# EAGLE design XT-03_Bit Reducer (EAGLE 9.5.1)
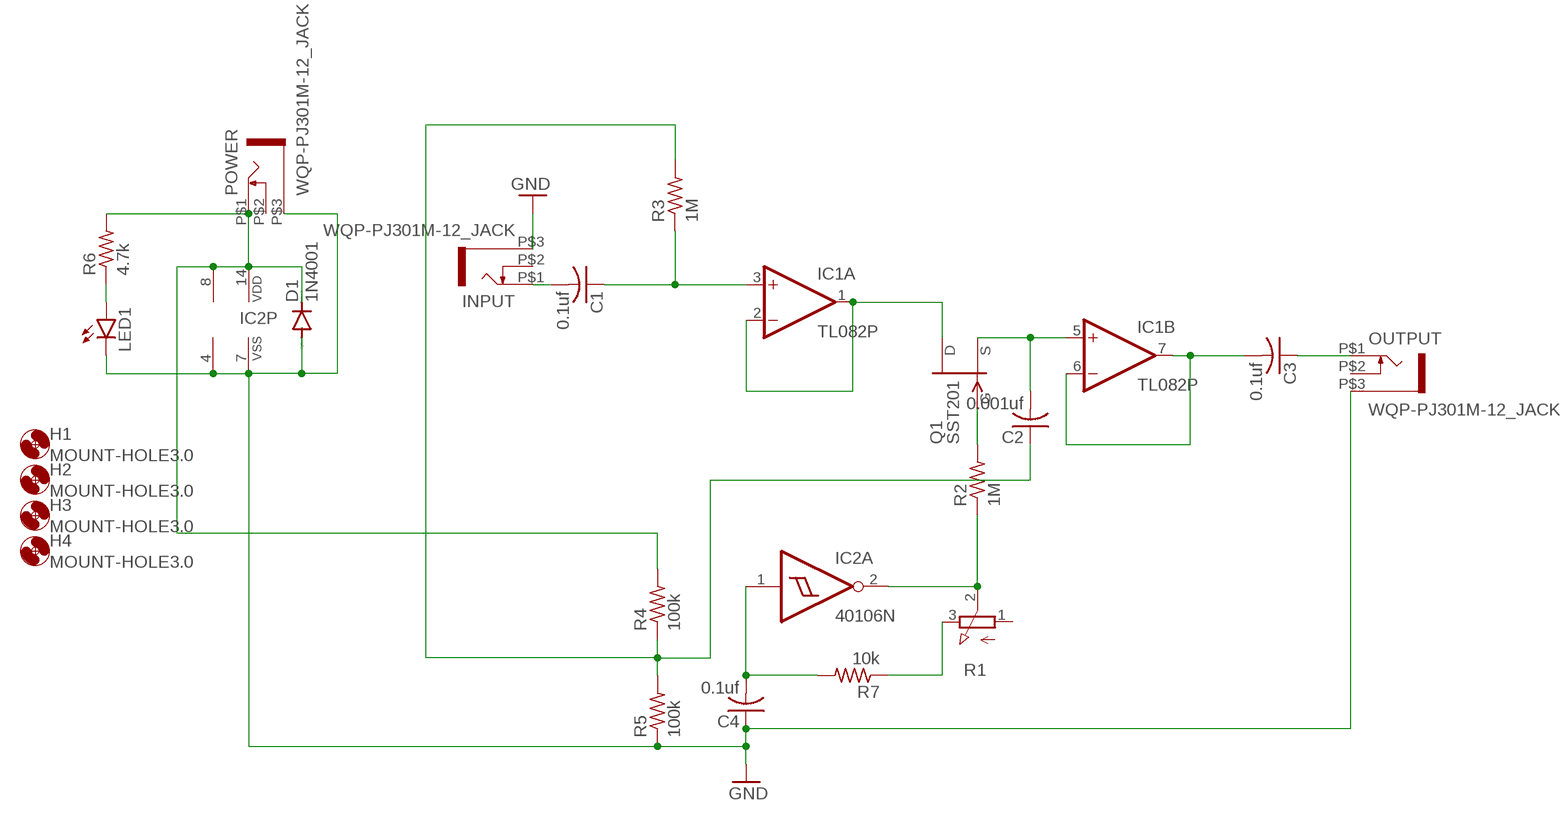
[diagram p0: schematic, sheet 1]

## Parts
C1  0.1uf  C-US050-025X075  [C050-025X075]
C2  0.001uf  C-US050-025X075  [C050-025X075]
C3  0.1uf  C-US050-025X075  [C050-025X075]
C4  0.1uf  C-US050-025X075  [C050-025X075]
D1  1N4001  1N4004  [DO41-10]
H1  MOUNT-HOLE3.0  [3,0]
H2  MOUNT-HOLE3.0  [3,0]
H3  MOUNT-HOLE3.0  [3,0]
H4  MOUNT-HOLE3.0  [3,0]
IC1  TL082P  [DIL08]
IC2  40106N  [DIL14]
INPUT  WQP-PJ301M-12_JACK  [WQP-PJ301M-12_JACK]
LED1  LED3MM  [LED3MM]
OUTPUT  WQP-PJ301M-12_JACK  [WQP-PJ301M-12_JACK]
POWER  WQP-PJ301M-12_JACK  [WQP-PJ301M-12_JACK]
Q1  SST201  [SOT23]
R1  EVUF2L  [EVUFXL]
R2  1M  R-US_0207/7  [0207/7]
R3  1M  R-US_0207/7  [0207/7]
R4  100k  R-US_0207/7  [0207/7]
R5  100k  R-US_0207/7  [0207/7]
R6  4.7k  R-US_0207/7  [0207/7]
R7  10k  R-US_0207/7  [0207/7]

## Nets
GND: C4.1 D1.A IC1.4(P:V-) IC2.7(P:VSS) INPUT.P$3 LED1.K(C) OUTPUT.P$3 POWER.P$3 R5.1
N$1: Q1.3(G) R2.2
N$2: IC1.1(A:OUT) IC1.2(A:-IN) Q1.1(D)
N$3: C1.1 IC1.3(A:+IN) R3.1
N$4: C2.2 IC1.5(B:+IN) Q1.2(S)
N$5: C3.2 IC1.6(B:-IN) IC1.7(B:OUT)
N$6: C1.2 INPUT.P$1
N$7: C2.1 R3.2 R4.1 R5.2
N$8: C3.1 OUTPUT.P$1
N$9: LED1.A R6.1
N$10: IC2.2(A:O) R1.2(S) R2.1
N$11: R1.3(E) R7.1
N$14: C4.2 IC2.1(A:I) R7.2
N$21: D1.C IC1.8(P:V+) IC2.14(P:VDD) POWER.P$1 R4.2 R6.2
Unconnected: IC2.3(B:I) IC2.4(B:O) IC2.5(C:I) IC2.6(C:O) IC2.8(D:O) IC2.9(D:I) IC2.10(E:O) IC2.11(E:I) IC2.12(F:O) IC2.13(F:I) INPUT.P$2 OUTPUT.P$2 POWER.P$2 R1.1(A)

## Library data of the parts
C1-C4 = rcl:C-US: CAPACITOR, American symbol; SPICEPREFIX: C
D1 = diode:1N4004: DIODE general purpose rectifier, 1 A
H1-H4 = holes:MOUNT-HOLE: MOUNTING HOLE with drill center marker
IC1 = linear:TL082: OP AMP Data sheet <http://www.ti.com/lit/ds/symlink/tl084a . pdf>; DATA_SHEET: <a href="http://www.ti.com/lit/ds/symlink/tl084a.pdf"> Data sheet </a>
IC2 = 40xx:40106: Hex SCHMITT TRIGGER
INPUT OUTPUT POWER = thonkiconn:WQP-PJ301M-12_JACK
LED1 = led:LED: LED OSRAM: - CHIPLED LG R971, LG N971, LY N971, LG Q971, LY Q971, LO R971, LY R971 LH N974, LH R974 LS Q976, LO Q976, LY Q976 LO Q996 - Hyper CHIPLED LW Q18S LB Q993, LB Q99A, LB R99A - SideLED LS A670, LO A670, LY A670, LG A670, LP A670 LB A673, LV A673, LT A673, LW A673 LH A674 LY A675 LS A676, LA A676, LO A676, LY A676, LW A676 LS A679, LY A679, LG A679 - Hyper Micro SIDELED® LS Y876, LA Y876, LO Y876, LY Y876 LT Y87S - SmartLED LW L88C, LW L88S LB L89C, LB L89S, LG L890 LS L89K, LO L89K, LY L89K LS L896, LA L896, LO L896, LY L896 - TOPLED LS T670, LO T670, LY T670, LG T670, LP T670 LSG T670, LSP T670, LSY T670, LOP T670, LYG T670 LG T671, LOG T671, LSG T671 LB T673, LV T673, LT T673, LW T673 LH T674 LS T676, LA T676, LO T676, LY T676, LB T676, LH T676, LSB T676, LW T676 LB T67C, LV T67C, LT T67C, LS T67K, LO T67K, LY T67K, LW E67C LS E67B, LA E67B, LO E67B, LY E67B, LB E67C, LV E67C, LT E67C LW T67C LS T679, LY T679, LG T679 LS T770, LO T770, LY T770, LG T770, LP T770 LB T773, LV T773, LT T773, LW T773 LH T774 LS E675, LA E675, LY E675, LS T675 LS T776, LA T776, LO T776, LY T776, LB T776 LHGB T686 LT T68C, LB T68C - Hyper Mini TOPLED® LB M676 - Mini TOPLED Santana® LG M470 LS M47K, LO M47K, LY M47K Source: http://www.osram.convergy.de LUXEON: - LUMILED® LXK2-PW12-R00, LXK2-PW12-S00, LXK2-PW14-U00, LXK2-PW14-V00 LXK2-PM12-R00, LXK2-PM12-S00, LXK2-PM14-U00 LXK2-PE12-Q00, LXK2-PE12-R00, LXK2-PE12-S00, LXK2-PE14-T00, LXK2-PE14-U00 LXK2-PB12-K00, LXK2-PB12-L00, LXK2-PB12-M00, LXK2-PB14-N00, LXK2-PB14-P00, LXK2-PB14-Q00 LXK2-PR12-L00, LXK2-PR12-M00, LXK2-PR14-Q00, LXK2-PR14-R00 LXK2-PD12-Q00, LXK2-PD12-R00, LXK2-PD12-S00 LXK2-PH12-R00, LXK2-PH12-S00 LXK2-PL12-P00, LXK2-PL12-Q00, LXK2-PL12-R00 Source: www.luxeon.com KINGBRIGHT: KA-3528ASYC Source: www.kingbright.com
Q1 = transistor-fet:?20*: TEMIC / Siliconix N-Channel JFET Source: JFET-J201_Siliconix_data.pdf
R1 = pot:EVU: 9 mm Square Rotary Potentiometers Source: Panasonic
R2-R7 = rcl:R-US_: RESISTOR, American symbol; SPICEPREFIX: R

## Board
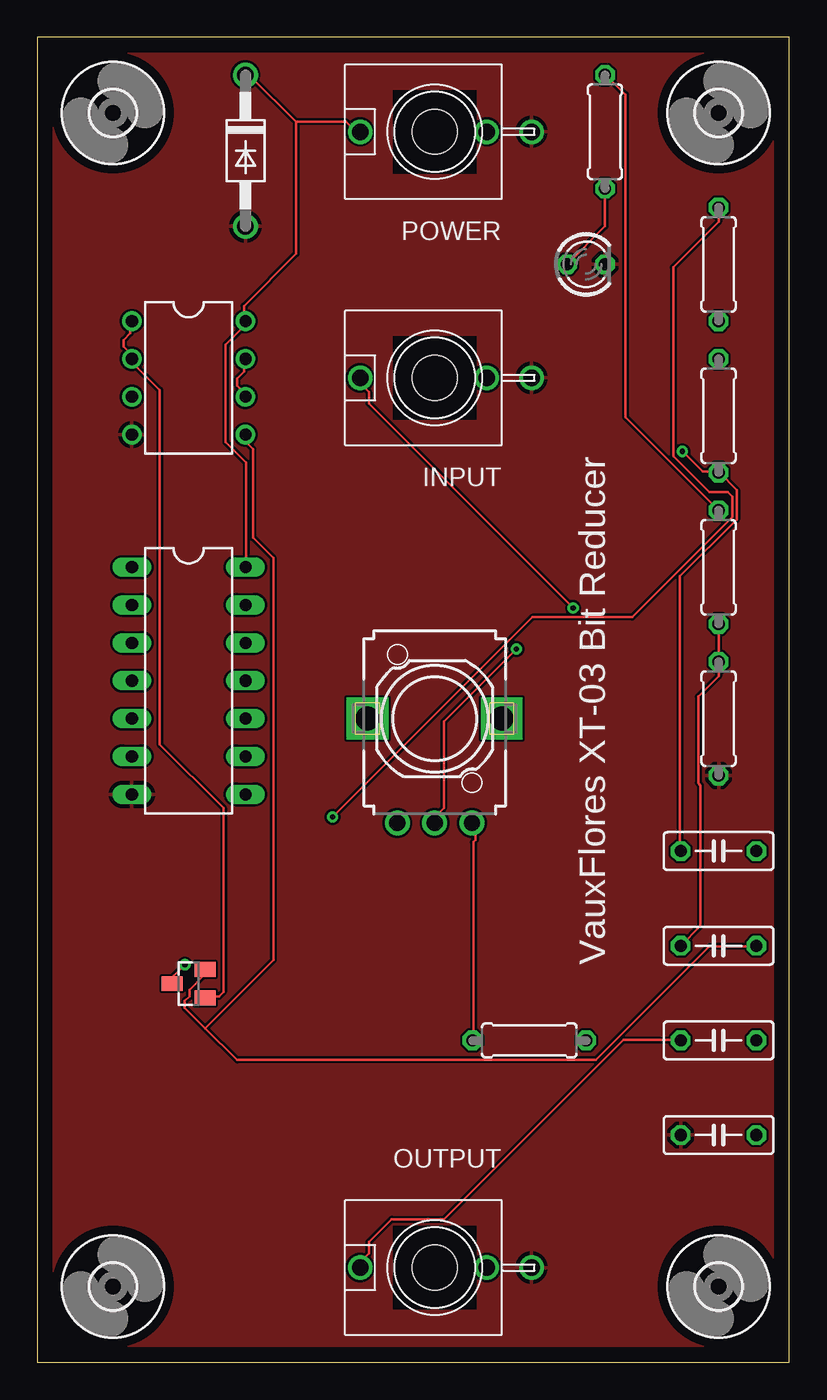
[diagram p1: board, top side]
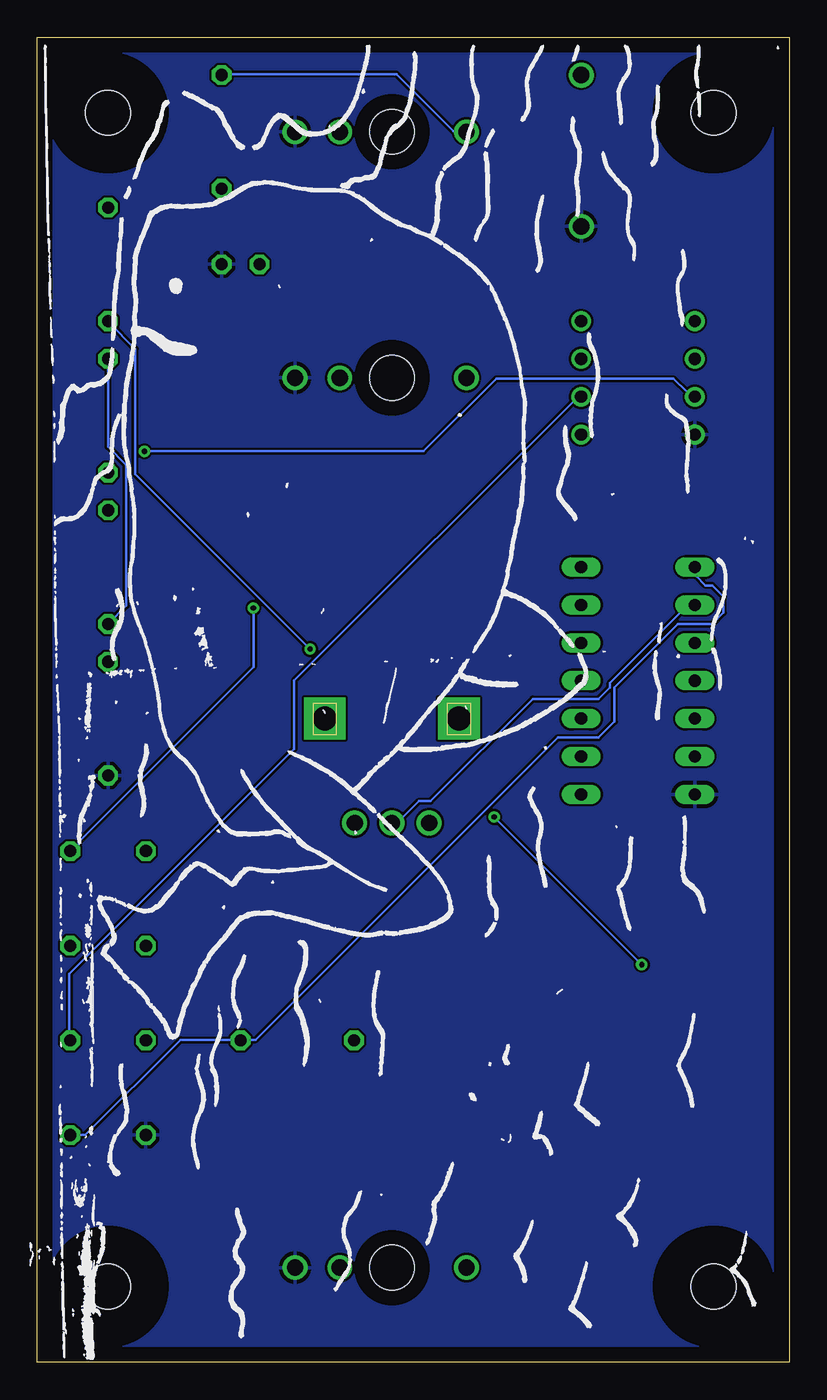
[diagram p2: board, bottom side, seen from below]

Size 50.47 x 88.89 mm. Coordinates in mm from the lower left corner, seen from the top.
Outline: 0,0 50.47,0 50.47,88.89 0,88.89 0,0
Copper layers (1*16): Top 0.035mm / dielectric 1.5mm / Bottom 0.035mm
Design rules "default": minimum track width 6mil, minimum drill 0.35mm, track to track 6mil, track to pad 6mil, pad to pad 6mil, via to via 6mil, smd to smd 6mil, copper to edge 40mil, drill to drill 6mil, minimum pad ring 10mil, minimum via ring 8mil, stop-mask expansion 4mil, vias tented up to drill 0mil, thermal gap 10mil
Holes 3 mm at 26.67,82.55 26.67,66.04 26.67,6.35

### Footprints (pad centres in the part's own frame; a part is rotated, then mirrored left to right if it is on the bottom)
C050-025X075 = drill 0.813 octagon: 1 -2.54,0; 2 2.54,0
DO41-10 = drill 1.118: A 5.08,0; C -5.08,0
3,0 = hole 3: 0,0
DIL08 = drill 0.813 pad 1.27: 1 -3.81,-3.81; 2 -1.27,-3.81; 3 1.27,-3.81; 4 3.81,-3.81; 5 3.81,3.81; 6 1.27,3.81; 7 -1.27,3.81; 8 -3.81,3.81
DIL14 = drill 0.813 long: 1 -7.62,-3.81; 2 -5.08,-3.81; 3 -2.54,-3.81; 4 0,-3.81; 5 2.54,-3.81; 6 5.08,-3.81; 7 7.62,-3.81; 8 7.62,3.81; 9 5.08,3.81; 10 2.54,3.81; 11 0,3.81; 12 -2.54,3.81; 13 -5.08,3.81; 14 -7.62,3.81
WQP-PJ301M-12_JACK = drill 1.1: P$1 0,5; P$2 0,-3.5; P$3 0,-6.5
LED3MM = drill 0.813 octagon: A -1.27,0; K 1.27,0
SOT23 = smd 1 x 1.4: 1 -0.95,-1.1; 2 0.95,-1.1; 3 0,1.1
EVUFXL = drill 1.1 pad 1.676: 1 -2.5,-7; 2 0,-7; 3 2.5,-7 | drill 1.6 pad 2.8 square: M1 4.5,0; M2 -4.5,0
0207/7 = drill 0.813 octagon: 1 -3.81,0; 2 3.81,0

### Placement (x,y rotation side)
C1  45.72,34.29 0 top
C2  45.72,27.94 0 top
C3  45.72,21.59 0 top
C4  45.72,15.24 0 top
D1  13.97,81.28 270 top
H1  5.08,83.82 0 top
H2  45.72,83.82 0 top
H3  5.08,5.08 0 top
H4  45.72,5.08 0 top
IC1  10.16,66.04 270 top
IC2  10.16,45.72 270 top
INPUT  26.67,66.04 90 top
LED1  36.83,73.66 0 top
OUTPUT  26.67,6.35 90 top
POWER  26.67,82.55 90 top
Q1  10.16,25.4 90 top
R1  26.67,43.18 0 top
R2  45.72,73.66 90 top
R3  45.72,63.5 90 top
R4  45.72,53.34 90 top
R5  45.72,43.18 90 top
R6  38.1,82.55 90 top
R7  33.02,21.59 0 top

### Tracks (layer width: path | path; a pad name or v marks a point on that pad's centre or on a via)
GND
  pour Top: 0,88.9 50.8,88.9 50.8,0 0,0
  pour Bottom: 0,88.9 50.8,88.9 50.8,0 0,0
N$1  (via drill 0.35)
  Top 0.152: v9.91,26.67 9.14,25.91 9.14,25.45 Q1.3 | v19.81,36.58 33.22,49.99 39.93,49.99 46.63,56.69 46.63,58.06 46.33,58.37 45.11,58.37 42.67,60.81 42.67,73.46 45.72,76.5 R2.2
  Bottom 0.152: v19.81,36.58 v9.91,26.67
N$2
  Top 0.152: Q1.1 11.28,24.54 12.19,24.54 12.5,24.84 12.5,37.19 8.23,41.45 8.23,65.23 6.25,67.21 IC1.2 6.25,67.36 6.25,67.67 5.79,68.12 5.79,68.58 6.25,69.04 6.25,69.8 IC1.1
N$3  (via drill 0.35)
  Top 0.152: v43.28,61.11 44.65,59.74 45.72,59.74 | 45.72,59.74 46.94,58.52 46.94,56.54 43.13,52.73 43.13,34.29 C1.1 | 45.72,59.74 R3.1
  Bottom 0.152: v43.28,61.11 24.54,61.11 19.66,65.99 7.77,65.99 6.86,65.08 6.71,65.08 6.4,64.77 IC1.3
N$4
  Top 0.152: 11.28,22.4 13.41,20.27 37.49,20.27 45.11,27.89 48.16,27.89 C2.2 | 11.28,22.4 9.91,23.77 9.91,24.23 10.21,24.54 10.21,24.99 11.12,25.91 11.12,26.21 Q1.2 | 11.28,22.4 15.85,26.98 15.85,53.95 14.48,55.32 14.48,61.27 14.02,61.72 14.02,62.18 IC1.5
N$5
  Top 0.152: IC1.7 13.87,67.21 13.87,66.45 13.41,65.99 13.41,65.53 13.87,65.08 13.87,64.77 IC1.6
  Bottom 0.152: IC1.6 14.17,64.77 33.22,45.72 33.22,41.15 48.31,26.06 48.31,21.64 C3.2
N$6  (via drill 0.35)
  Top 0.152: v35.97,50.6 22.25,64.31 22.25,65.08 21.79,65.53 21.79,65.99 INPUT.P$1
  Bottom 0.152: v35.97,50.6 35.97,46.63 47.7,34.9 47.7,34.75 48.16,34.29 C1.2
N$7
  Top 0.152: C2.1 44.5,29.26 44.5,38.71 44.35,38.86 44.35,44.65 45.72,46.02 R5.2 R4.1
  Bottom 0.152: R3.2 45.72,61.42 44.5,60.2 44.5,50.75 R4.1
N$8
  Top 0.152: C3.1 43.13,21.64 39.32,21.64 27.28,9.6 23.77,9.6 22.25,8.08 22.25,7.32 21.79,6.86 21.79,6.4 OUTPUT.P$1
N$9
  Top 0.152: LED1.A 38.1,76.2 R6.1
N$10  (via drill 0.35)
  Top 0.152: v32.16,47.85 27.28,42.98 27.28,37.19 26.67,36.58 R1.2
  Bottom 0.152: IC2.2 6.4,50.75 6.86,50.75 12.04,45.57 12.04,45.26 12.8,44.5 17.22,44.5 24.08,37.64 24.84,37.64 26.21,36.27 26.67,36.27 R1.2 | v32.16,47.85 43.89,59.59 43.89,67.97 45.72,69.8 R2.1
N$11
  Top 0.152: R7.1 29.26,21.64 29.26,34.9 29.41,35.05 29.41,35.97 29.26,36.12 R1.3
N$14
  Bottom 0.152: C4.2 47.24,15.24 40.84,21.64 36.88,21.64 R7.2 36.73,21.64 35.81,21.64 15.54,41.91 12.8,41.91 11.73,42.98 11.73,45.26 7.47,49.53 5.18,49.53 4.42,50.29 4.42,51.36 5.18,52.12 5.64,52.12 6.25,52.73 6.25,53.34 IC2.1
N$21
  Top 0.152: IC2.14 14.02,53.34 14.02,60.35 12.65,61.72 12.65,68.28 13.87,69.49 13.87,69.8 IC1.8 13.87,69.95 13.87,70.87 17.37,74.37 17.37,83.21 | R4.2 39.47,63.4 39.47,85.04 38.1,86.41 R6.2 | 17.37,83.21 14.33,86.26 14.02,86.26 D1.C | 17.37,83.21 20.73,83.21 21.34,82.6 21.64,82.6 POWER.P$1
  Bottom 0.152: R6.2 38.1,86.41 26.36,86.41 22.55,82.6 21.79,82.6 POWER.P$1

### Text on the board
tNames: VauxFlores XT-03 Bit Reducer